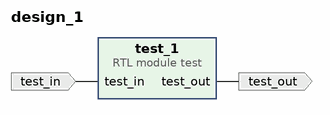
[diagram p0: block diagram of the top level]
# Vivado block design design_1, xc7z010clg225-1, Vivado 2017.1
create_bd_design design_1

create_bd_port -dir I test_in
create_bd_port -dir O test_out

create_bd_cell -type module -reference test test_1

# ---- connections ----

connect_bd_net [get_bd_ports test_in] [get_bd_pins test_1/test_in]
connect_bd_net -net test_0__out [get_bd_pins test_1/test_out] [get_bd_ports test_out]

validate_bd_design
save_bd_design
